# Altium schematic sheet EFR32.SchDoc: EFR32BG13
size Letter; DrawnBy: Vishnu Kumar; DocumentNumber: 1; Revision: 1; SheetNumber: 2; SheetTotal: 3
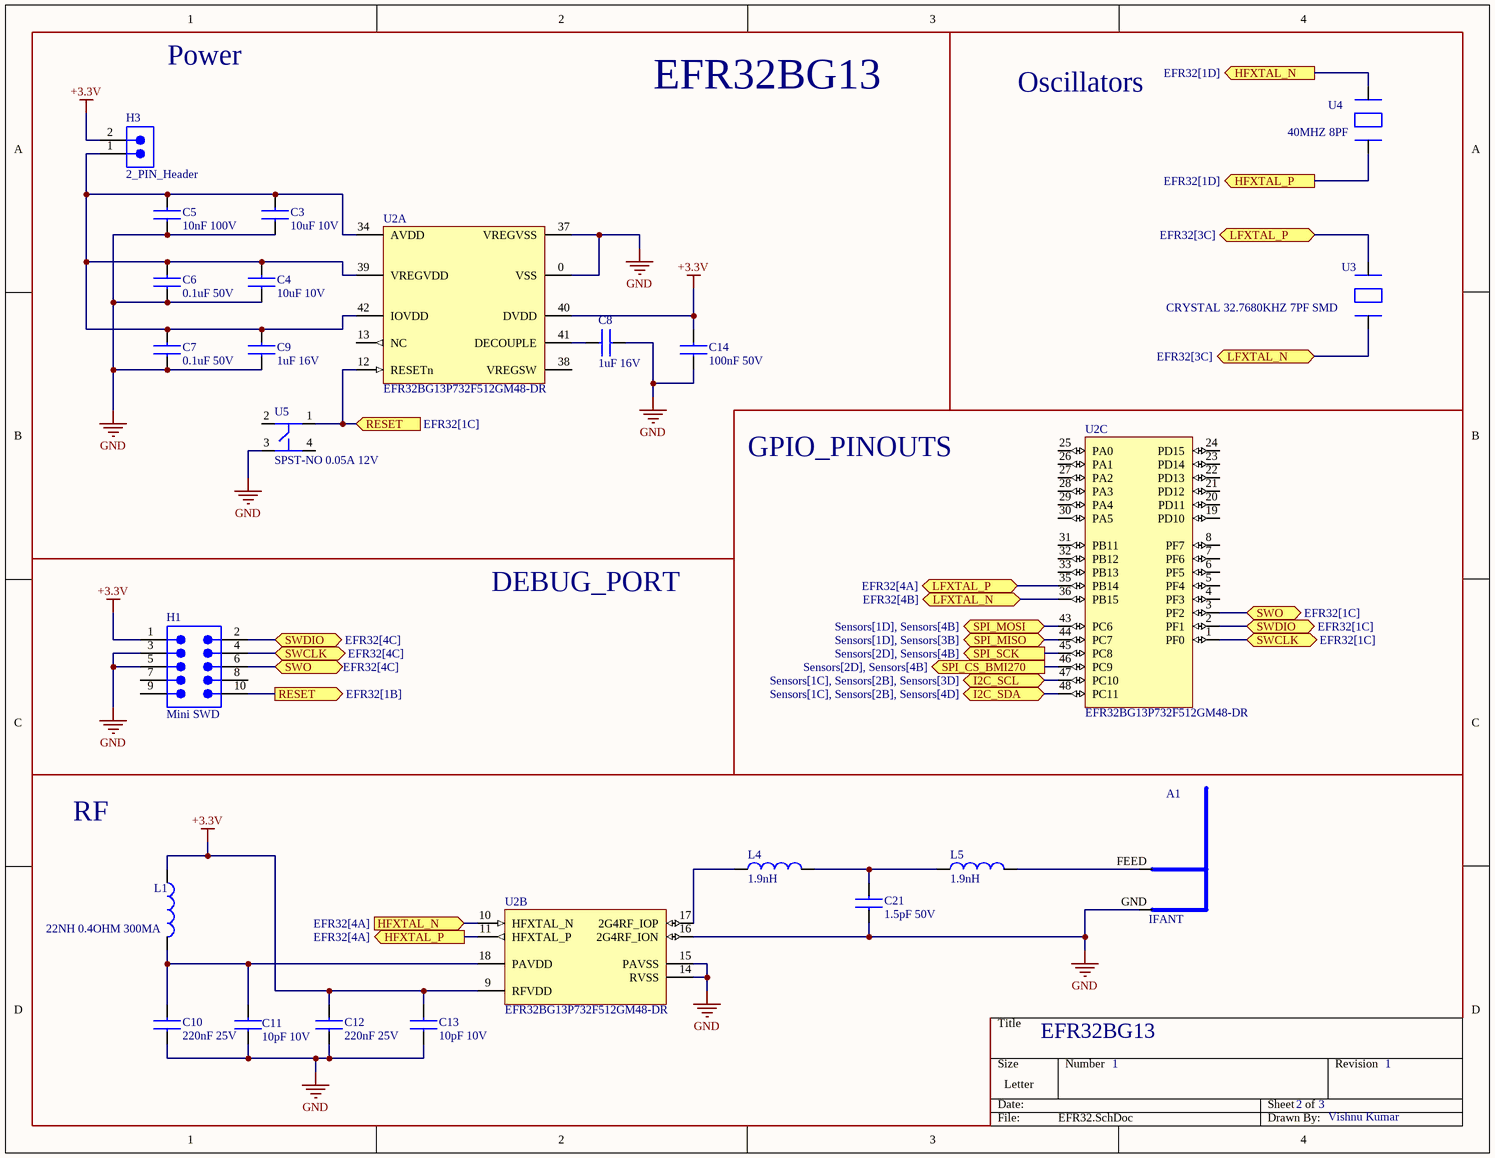
[diagram p0: EFR32.SchDoc]

## Parts
A1  IFANT  [IFANT_2P4]
C3  10uF 10V  [CAP_0603_1MM]
C4  10uF 10V  [CAP_0603_1MM]
C5  10nF 100V  [CAP_0603_1MM]
C6  0.1uF 50V  [CAP_0603_1MM]
C7  0.1uF 50V  [CAP_0603_1MM]
C8  1uF 16V  [CAP_0603_1MM]
C9  1uF 16V  [CAP_0603_1MM]
C10  220nF 25V  [CAP_0603_1MM]
C11  10pF 10V  [CAP_0603_1MM]
C12  220nF 25V  [CAP_0603_1MM]
C13  10pF 10V  [CAP_0603_1MM]
C14  100nF 50V  [CAP_0603_1MM]
C21  1.5pF 50V  [CAPC1005X55N]
H1  Mini SWD  [FTSH-105-01-XXX-DV-K]
H3  2_PIN_Header  [2-PIN_MALE_HEADER_01-IN]
L1  22NH 0.4OHM 300MA  [IND_0603_1MM]
L4  1.9nH  [CAPC1005X55N]
L5  1.9nH  [CAPC1005X55N]
U2  EFR32BG13P732F512GM48-DR  [QFN48P700X700X90_HS-49N]  (parts A,B,C of 3)
U3  CRYSTAL 32.7680KHZ 7PF SMD  [Oscillator_32.768kHz_SC32S-7PF20PPM]
U4  40MHZ 8PF  [OSCILLATOR_40MHz_LNCD1-40M]
U5  SPST-NO 0.05A 12V  [SPDT Switch]

## Ports
HFXTAL_N (in, see EFR32[4A]), HFXTAL_N (out, see EFR32[1D]), HFXTAL_P (out, see EFR32[1D]), HFXTAL_P (out, see EFR32[4A]), I2C_SCL (bidir, see Sensors[1C], Sensors[2B], Sensors[3D]), I2C_SDA (bidir, see Sensors[1C], Sensors[2B], Sensors[4D]), LFXTAL_N (bidir, see EFR32[3C]), LFXTAL_N (bidir, see EFR32[4B]), LFXTAL_P (bidir, see EFR32[3C]), LFXTAL_P (bidir, see EFR32[4A]), RESET (in, see EFR32[1C]), RESET (out, see EFR32[1B]), SPI_CS_BMI270 (out, see Sensors[2D], Sensors[4B]), SPI_MISO (bidir, see Sensors[1D], Sensors[3B]), SPI_MOSI (bidir, see Sensors[1D], Sensors[4B]), SPI_SCK (out, see Sensors[2D], Sensors[4B]), SWCLK (bidir, see EFR32[1C]), SWCLK (bidir, see EFR32[4C]), SWDIO (bidir, see EFR32[1C]), SWDIO (bidir, see EFR32[4C]), SWO (bidir, see EFR32[1C]), SWO (bidir, see EFR32[4C])

## Nets
+3.3V: C12.1 C13.2 C14.1 H1.1 H3.2 L1.1 U2.9(RFVDD) U2.40(DVDD)
GND: A1.GND C3.2 C4.2 C5.1 C6.1 C7.2 C8.2 C9.2 C10.2 C11.2 C12.2 C13.1 C14.2 C21.2 H1.3 H1.5 U2.0(VSS) U2.14(RVSS) U2.15(PAVSS) U2.16(2G4RF_ION) U2.37(VREGVSS) U5.3
HFXTAL_N: U2.10(HFXTAL_N) U4.1 ; port HFXTAL_N
HFXTAL_P: U2.11(HFXTAL_P) U4.2 ; port HFXTAL_P
I2C_SCL: U2.47(PC10) ; port I2C_SCL
I2C_SDA: U2.48(PC11) ; port I2C_SDA
LFXTAL_N: U2.36(PB15) U3.1 ; port LFXTAL_N
LFXTAL_P: U2.35(PB14) U3.2 ; port LFXTAL_P
RESET: H1.10 U2.12(RESETn) U5.1 ; port RESET
SPI_CS_BMI270: U2.46(PC9) ; port SPI_CS_BMI270
SPI_MISO: U2.44(PC7) ; port SPI_MISO
SPI_MOSI: U2.43(PC6) ; port SPI_MOSI
SPI_SCK: U2.45(PC8) ; port SPI_SCK
SWCLK: H1.4 U2.1(PF0) ; port SWCLK
SWDIO: H1.2 U2.2(PF1) ; port SWDIO
SWO: H1.6 U2.3(PF2) ; port SWO
NetA1_FEED: A1.FEED L5.2
NetC3_1: C3.1 C4.1 C5.2 C6.2 C7.1 C9.1 H3.1 U2.34(AVDD) U2.39(VREGVDD) U2.42(IOVDD)
NetC8_1: C8.1 U2.41(DECOUPLE)
NetC10_1: C10.1 C11.1 L1.2 U2.18(PAVDD)
NetC21_1: C21.1 L4.2 L5.1
NetL4_1: L4.1 U2.17(2G4RF_IOP)

Not connected (* = marked no-connect by the designer): H1 7 8 9; U2 4(PF3) 5(PF4) 6(PF5) 7(PF6) 8(PF7) 13(NC) 19(PD10) 20(PD11) 21(PD12) 22(PD13) 23(PD14) 24(PD15) 25(PA0) 26(PA1) 27(PA2) 28(PA3) 29(PA4) 30(PA5) 31(PB11) 32(PB12) 33(PB13) 38(VREGSW); U5 2 4

## Notes on the sheet
- Power
- EFR32BG13
- Oscillators
- GPIO_PINOUTS
- DEBUG_PORT
- RF

## Library data of the parts
A1 = IFANT_2P4
C3 C4 = CC_10uF_10v_0603: Ceramic Capacitor, Multilayer, Ceramic, 10V, 20% +Tol, 20% -Tol, X5R, 15% TC, 10uF, Surface Mount, 0603; Manufacturer: Cal-Chip Electronics; Manufacturer Part Number: GMC10X5R106M10NT; Multilayer: Yes; Supplier: Digikey; Supplier Part Number: 4713-GMC10X5R106M10NTCT-ND; RoHS: Yes; Stock: 109451; Pricing: 1=0.1, 10=0.053, 50=0.0362, 100=0.0312, 500=0.02258, 1000=0.01991 (USD); Mounting Technology: Surface Mount; Pins: 2; Dielectric Material: Ceramic; Package Shape: Rectangular; Case/Package: 0603; Terminal Finish: Nickel; Min Operating Temperature: -55°C; Max Operating Temperature: 85°C; JESD-609 Code: e3; Value: 10uF; Capacitor Type: Ceramic; Tolerance  (fill in as +-): 20%; Package Style: SMTMeter; Packaging: Tape and Reel; Tolerance (fill in as +-): 20%; Rated DC Voltage (URdc): 10V; Temperature Characteristics Code: X5R; Termination: Wraparound; Length: 1.6mm; Width: 0.8mm; Height: 0.8mm; Reach SVHC Compliant: Yes; RoHS Compliant: Yes; ComponentLink1URL: https://datasheet.ciiva.com:443/pdfs/VipMasterIC/IC/CALC/CALC-S-A0005264378/CALC-S-A0005264378-1.pdf?src-supplier=IHS+Markit; ComponentLink1Description: https://datasheet.ciiva.com:443/pdfs/VipMasterIC/IC/CALC/CALC-S-A0005264378/CALC-S-A0005264378-1.pdf?src-supplier=IHS+Markit
C5 = GCM188R72A103KA37D: Ceramic Capacitor, Multilayer, Ceramic, 100V, 10% +Tol, 10% -Tol, X7R, 15% TC, 0.01uF, Surface Mount, 0603; Manufacturer: Murata; Multilayer: Yes; Reference Standard: AEC-Q200; Supplier: Digikey; Supplier Part Number: 490-4781-1-ND; Manufacturer Part Number: GCM188R72A103KA37D; RoHS: Yes; Category: Ceramic Capacitors; Stock: 6381052; Pricing: 1=0.1, 10=0.03, 50=0.0204, 100=0.0174, 500=0.0125, 1000=0.01097 (USD); Mounting Technology: Surface Mount; Pins: 2; Dielectric Material: Ceramic; Package Shape: Rectangular; Case/Package: 0603; Terminal Finish: Nickel; Min Operating Temperature: -55°C; Max Operating Temperature: 125°C; JESD-609 Code: e3; Value: 10nF; Capacitor Type: Ceramic; Tolerance  (fill in as +-): 10%; Package Style: SMTMeter; Packaging: Tape and Reel; Tolerance (fill in as +-): 10%; Rated DC Voltage (URdc): 100V; Temperature Characteristics Code: X7R; Termination: Wraparound; Length: 1.6mm; Width: 0.8mm; Height: 0.9mm; Reach SVHC Compliant: Yes; RoHS Compliant: Yes; ComponentLink1URL: https://psearch.en.murata.com:443/capacitor/product/GCM188R72A103KA37%23.pdf?src-supplier=IHS+Markit; ComponentLink1Description: https://psearch.en.murata.com:443/capacitor/product/GCM188R72A103KA37%23.pdf?src-supplier=IHS+Markit; ComponentLink2URL: https://datasheet.ciiva.com/132/product-132907.pdf?src-supplier=Digikey; ComponentLink2Description: https://datasheet.ciiva.com/132/product-132907.pdf?src-supplier=Digikey; ComponentLink3URL: https://datasheet.ciiva.com/132/product-132908.pdf?src-supplier=Digikey; ComponentLink3Description: https://datasheet.ciiva.com/132/product-132908.pdf?src-supplier=Digikey; ComponentLink4URL: https://datasheet.ciiva.com/132/product-132909.pdf?src-supplier=Digikey; ComponentLink4Description: https://datasheet.ciiva.com/132/product-132909.pdf?src-supplier=Digikey; ComponentLink5URL: https://datasheet.ciiva.com/11786/0900766b80ef92d0-11786108.pdf?src-supplier=Rs; ComponentLink5Description: https://datasheet.ciiva.com/11786/0900766b80ef92d0-11786108.pdf?src-supplier=Rs; ComponentLink6URL: https://datasheet.ciiva.com/16497/product-16497251.pdf?src-supplier=Future+Electronics; ComponentLink6Description: https://datasheet.ciiva.com/16497/product-16497251.pdf?src-supplier=Future+Electronics; ComponentLink7URL: https://datasheet.ciiva.com/18183/getdatasheetpartid-178890-18183651.pdf?src-supplier=Verical; ComponentLink7Description: https://datasheet.ciiva.com/18183/getdatasheetpartid-178890-18183651.pdf?src-supplier=Verical; ComponentLink8URL: https://datasheet.ciiva.com/11619/product-11619719.pdf?src-supplier=Avnet; ComponentLink8Description: https://datasheet.ciiva.com/11619/product-11619719.pdf?src-supplier=Avnet
C6 C7 = CC_0.1uF_0603_ZRY5V9BB104: Ceramic Capacitor, Multilayer, Ceramic, 50V, 80% +Tol, 20% -Tol, Y5V, -82/+22% TC, 0.1uF, Surface Mount, 0603; Manufacturer: Yageo; Manufacturer Part Number: CC0603ZRY5V9BB104; Value: 100nF; Multilayer: Yes; Supplier: Digikey; Supplier Part Number: 311-1343-1-ND; RoHS: Yes; Category: Ceramic Capacitors; Stock: 7870307; Pricing: 1=0.1, 10=0.028, 50=0.0162, 100=0.0125, 500=0.00944, 1000=0.00742 (USD); Mounting Technology: Surface Mount; Pins: 2; Dielectric Material: Ceramic; Package Shape: Rectangular; Case/Package: 0603; Terminal Finish: Nickel; Min Operating Temperature: -30°C; Max Operating Temperature: 85°C; JESD-609 Code: e3; Capacitor Type: Ceramic; Tolerance  (fill in as +-): 20%; Package Style: SMTMeter; Packaging: Tape and Reel; Tolerance (fill in as +-): 80%; Rated DC Voltage (URdc): 50V; Temperature Characteristics Code: Y5V; Termination: Wraparound; Length: 1.6mm; Width: 0.8mm; Height: 0.8mm; Reach SVHC Compliant: Yes; RoHS Compliant: Yes; ComponentLink1URL: https://datasheet.ciiva.com:443/pdfs/VipMasterIC/IC/YAGO/YAGO-S-A0004841839/YAGO-S-A0004841839-1.pdf?src-supplier=IHS+Markit; ComponentLink1Description: https://datasheet.ciiva.com:443/pdfs/VipMasterIC/IC/YAGO/YAGO-S-A0004841839/YAGO-S-A0004841839-1.pdf?src-supplier=IHS+Markit; ComponentLink2URL: https://datasheet.ciiva.com/144/mlccorderingcode-144027.pdf?src-supplier=Digikey; ComponentLink2Description: https://datasheet.ciiva.com/144/mlccorderingcode-144027.pdf?src-supplier=Digikey; ComponentLink3URL: https://datasheet.ciiva.com/11786/0900766b8079c870-11786029.pdf?src-supplier=Rs; ComponentLink3Description: https://datasheet.ciiva.com/11786/0900766b8079c870-11786029.pdf?src-supplier=Rs; ComponentLink4URL: https://datasheet.ciiva.com/144/mlccorderingcode-144025.pdf?src-supplier=Digikey; ComponentLink4Description: https://datasheet.ciiva.com/144/mlccorderingcode-144025.pdf?src-supplier=Digikey; ComponentLink5URL: https://datasheet.ciiva.com/144/mlccorderingcode-144026.pdf?src-supplier=Digikey; ComponentLink5Description: https://datasheet.ciiva.com/144/mlccorderingcode-144026.pdf?src-supplier=Digikey; ComponentLink6URL: https://datasheet.ciiva.com/5427/upy-gphc-y5v-6-3v-to-50v-5-5427420.pdf?src-supplier=Mouser; ComponentLink6Description: https://datasheet.ciiva.com/5427/upy-gphc-y5v-6-3v-to-50v-5-5427420.pdf?src-supplier=Mouser; ComponentLink7URL: https://datasheet.ciiva.com/28450/1132289-28450702.pdf?src-supplier=Element14; ComponentLink7Description: https://datasheet.ciiva.com/28450/1132289-28450702.pdf?src-supplier=Element14; ComponentLink8URL: https://datasheet.ciiva.com/26829/getdatasheetpartid-403611-26829467.pdf?src-supplier=Verical; ComponentLink8Description: https://datasheet.ciiva.com/26829/getdatasheetpartid-403611-26829467.pdf?src-supplier=Verical
C8 C9 = CC_1uF_16v_0603: Ceramic Capacitor, Multilayer, Ceramic, 16V, 10% +Tol, 10% -Tol, X5R, 15% TC, 1uF, Surface Mount, 0603; Manufacturer: Samsung; Manufacturer Part Number: CL10A105KO8NNND; Multilayer: Yes; Supplier: Digikey; Supplier Part Number: 1276-CL10A105KO8NNNDCT-ND; RoHS: Yes; Category: Ceramic Capacitors; Stock: 29219; Pricing: 1=0.1, 10=0.029, 50=0.0194, 100=0.0165, 500=0.01166, 1000=0.01017, 2500=0.0086, 5000=0.00764 (USD); Mounting Technology: Surface Mount; Pins: 2; Dielectric Material: Ceramic; Package Shape: Rectangular; Case/Package: 0603; Terminal Finish: Nickel; Min Operating Temperature: -55°C; Max Operating Temperature: 85°C; JESD-609 Code: e3; Value: 1uF; Capacitor Type: Ceramic; Tolerance  (fill in as +-): 10%; Package Style: SMTMeter; Packaging: Tape and Reel; Tolerance (fill in as +-): 10%; Rated DC Voltage (URdc): 16V; Temperature Characteristics Code: X5R; Termination: Wraparound; Length: 1.6mm; Width: 0.8mm; Height: 0.9mm; Reach SVHC Compliant: Yes; RoHS Compliant: Yes; ComponentLink1URL: https://datasheet.ciiva.com:443/pdfs/VipMasterIC/IC/SEMS/SEMS-S-A0008520814/SEMS-S-A0008520822-1.pdf?src-supplier=IHS+Markit; ComponentLink1Description: https://datasheet.ciiva.com:443/pdfs/VipMasterIC/IC/SEMS/SEMS-S-A0008520814/SEMS-S-A0008520822-1.pdf?src-supplier=IHS+Markit; ComponentLink2URL: https://datasheet.ciiva.com/15195/getdatasheetpartid-353183-15195707.pdf?src-supplier=Verical; ComponentLink2Description: https://datasheet.ciiva.com/15195/getdatasheetpartid-353183-15195707.pdf?src-supplier=Verical
C10 C12 = CC_220nF_25V_0603: Ceramic Capacitor, Multilayer, Ceramic, 25V, 10% +Tol, 10% -Tol, X5R, 15% TC, 0.22uF, Surface Mount, 0603; Manufacturer: Walsin Technologies; Manufacturer Part Number: 0603X224K250CT; Multilayer: Yes; Supplier: Digikey; Supplier Part Number: 1292-1552-1-ND; RoHS: Yes; Category: Ceramic Capacitors; Stock: 22060; Pricing: 1=0.1, 10=0.037, 50=0.0212, 100=0.0164, 500=0.01234, 1000=0.00969 (USD); Mounting Technology: Surface Mount; Pins: 2; Dielectric Material: Ceramic; Package Shape: Rectangular; Case/Package: 0603; Terminal Finish: Nickel; Min Operating Temperature: -55°C; Max Operating Temperature: 85°C; JESD-609 Code: e3; Value: 220nF; Capacitor Type: Ceramic; Tolerance  (fill in as +-): 10%; Package Style: SMTMeter; Packaging: Tape and Reel; Tolerance (fill in as +-): 10%; Rated DC Voltage (URdc): 25V; Temperature Characteristics Code: X5R; Termination: Wraparound; Length: 1.6mm; Width: 0.8mm; Height: 0.8mm; Reach SVHC Compliant: Yes; RoHS Compliant: Yes; ComponentLink1URL: https://datasheet.ciiva.com:443/pdfs/VipMasterIC/IC/WATC/WATC-S-A0009550342/WATC-S-A0009550342-1.pdf?src-supplier=IHS+Markit; ComponentLink1Description: https://datasheet.ciiva.com:443/pdfs/VipMasterIC/IC/WATC/WATC-S-A0009550342/WATC-S-A0009550342-1.pdf?src-supplier=IHS+Markit; ComponentLink2URL: http://www.farnell.com/datasheets/1958513.pdf?src-supplier=Farnell; ComponentLink2Description: http://www.farnell.com/datasheets/1958513.pdf?src-supplier=Farnell; ComponentLink3URL: https://datasheet.octopart.com/0603X224K250CT-Walsin-Technologies-datasheet-85392065.pdf?src-supplier=Element14; ComponentLink3Description: https://datasheet.octopart.com/0603X224K250CT-Walsin-Technologies-datasheet-85392065.pdf?src-supplier=Element14; ComponentLink4URL: http://www.passivecomponent.com/wp-content/uploads/2018/10/MLCC.pdf?src-supplier=Digikey; ComponentLink4Description: http://www.passivecomponent.com/wp-content/uploads/2018/10/MLCC.pdf?src-supplier=Digikey; ComponentLink5URL: https://datasheet.octopart.com/0603X224K250CT-Walsin-Technologies-datasheet-157857041.pdf?src-supplier=Future+Electronics; ComponentLink5Description: https://datasheet.octopart.com/0603X224K250CT-Walsin-Technologies-datasheet-157857041.pdf?src-supplier=Future+Electronics; ComponentLink6URL: https://datasheet.octopart.com/0603X224K250CT-Walsin-Technologies-datasheet-136037192.pdf?src-supplier=TECHDesign; ComponentLink6Description: https://datasheet.octopart.com/0603X224K250CT-Walsin-Technologies-datasheet-136037192.pdf?src-supplier=TECHDesign
C11 C13 = CC_10pF_10V_0603: 10 pF ±5% 10V Ceramic Capacitor C0G, NP0 0603 (1608 Metric); Supplier: Digikey; Supplier Part Number: 732-7746-1-ND
C14 = CC_0.1uF_0603_ZRY5V9BB104: Ceramic Capacitor, Multilayer, Ceramic, 50V, 80% +Tol, 20% -Tol, Y5V, -82/+22% TC, 0.1uF, Surface Mount, 0603; Manufacturer: Yageo; Manufacturer Part Number: CC0603ZRY5V9BB104; Multilayer: Yes; Supplier: Digikey; Supplier Part Number: 311-1343-1-ND; RoHS: Yes; Category: Ceramic Capacitors; Stock: 7870307; Pricing: 1=0.1, 10=0.028, 50=0.0162, 100=0.0125, 500=0.00944, 1000=0.00742 (USD); Mounting Technology: Surface Mount; Pins: 2; Dielectric Material: Ceramic; Package Shape: Rectangular; Case/Package: 0603; Terminal Finish: Nickel; Min Operating Temperature: -30°C; Max Operating Temperature: 85°C; JESD-609 Code: e3; Value: 100nF; Capacitor Type: Ceramic; Tolerance  (fill in as +-): 20%; Package Style: SMTMeter; Packaging: Tape and Reel; Tolerance (fill in as +-): 80%; Rated DC Voltage (URdc): 50V; Temperature Characteristics Code: Y5V; Termination: Wraparound; Length: 1.6mm; Width: 0.8mm; Height: 0.8mm; Reach SVHC Compliant: Yes; RoHS Compliant: Yes; ComponentLink1URL: https://datasheet.ciiva.com:443/pdfs/VipMasterIC/IC/YAGO/YAGO-S-A0004841839/YAGO-S-A0004841839-1.pdf?src-supplier=IHS+Markit; ComponentLink1Description: https://datasheet.ciiva.com:443/pdfs/VipMasterIC/IC/YAGO/YAGO-S-A0004841839/YAGO-S-A0004841839-1.pdf?src-supplier=IHS+Markit; ComponentLink2URL: https://datasheet.ciiva.com/144/mlccorderingcode-144027.pdf?src-supplier=Digikey; ComponentLink2Description: https://datasheet.ciiva.com/144/mlccorderingcode-144027.pdf?src-supplier=Digikey; ComponentLink3URL: https://datasheet.ciiva.com/11786/0900766b8079c870-11786029.pdf?src-supplier=Rs; ComponentLink3Description: https://datasheet.ciiva.com/11786/0900766b8079c870-11786029.pdf?src-supplier=Rs; ComponentLink4URL: https://datasheet.ciiva.com/144/mlccorderingcode-144025.pdf?src-supplier=Digikey; ComponentLink4Description: https://datasheet.ciiva.com/144/mlccorderingcode-144025.pdf?src-supplier=Digikey; ComponentLink5URL: https://datasheet.ciiva.com/144/mlccorderingcode-144026.pdf?src-supplier=Digikey; ComponentLink5Description: https://datasheet.ciiva.com/144/mlccorderingcode-144026.pdf?src-supplier=Digikey; ComponentLink6URL: https://datasheet.ciiva.com/5427/upy-gphc-y5v-6-3v-to-50v-5-5427420.pdf?src-supplier=Mouser; ComponentLink6Description: https://datasheet.ciiva.com/5427/upy-gphc-y5v-6-3v-to-50v-5-5427420.pdf?src-supplier=Mouser; ComponentLink7URL: https://datasheet.ciiva.com/28450/1132289-28450702.pdf?src-supplier=Element14; ComponentLink7Description: https://datasheet.ciiva.com/28450/1132289-28450702.pdf?src-supplier=Element14; ComponentLink8URL: https://datasheet.ciiva.com/26829/getdatasheetpartid-403611-26829467.pdf?src-supplier=Verical; ComponentLink8Description: https://datasheet.ciiva.com/26829/getdatasheetpartid-403611-26829467.pdf?src-supplier=Verical
C21 = CC_1.5pF_885012005050: 1.5 pF ±0.5pF 50V Ceramic Capacitor C0G, NP0 0402 (1005 Metric); Manufacturer: Wurth Electronics; Supplier: Digikey; Supplier Part Number: 732-12249-1-ND; Manufacturer Part Number: 885012005050; RoHS: Yes; Category: Ceramic Capacitors; Stock: 24790; Pricing: 1=0.1, 10=0.015, 100=0.014, 500=0.012 (USD); Pins: 2; Dielectric Material: Ceramic; Capacitor Type: Ceramic; Reach SVHC Compliant: Yes; RoHS Compliant: Yes; ComponentLink1URL: https://datasheet.ciiva.com:443/pdfs/VipMasterIC/IC/MIDC/MIDC-S-A0001525369/MIDC-S-A0001525129-1.pdf?src-supplier=IHS+Markit; ComponentLink1Description: https://datasheet.ciiva.com:443/pdfs/VipMasterIC/IC/MIDC/MIDC-S-A0001525369/MIDC-S-A0001525129-1.pdf?src-supplier=IHS+Markit; ComponentLink2URL: https://katalog.we-online.de/pbs/datasheet/885012005050.pdf?src-supplier=Digikey; ComponentLink2Description: https://katalog.we-online.de/pbs/datasheet/885012005050.pdf?src-supplier=Digikey
H1 = Debug Connector Mini SWD - 0.05": Mini SWD 0.05" Pitch Connector - 10 Pin SMT Box Header; Manufacturer: Adafruit Industries; Manufacturer Part Number: 4048; Supplier 1: Digi-Key; RoHS: No; Category: Connectors; Stock 1: 201; Pricing 1: 1=1.95000 (USD); ComponentLink1URL: https://media.digikey.com/pdf/Data%20Sheets/Adafruit%20PDFs/4048_Web.pdf?src-supplier=Digi-Key; ComponentLink1Description: https://media.digikey.com/pdf/Data%20Sheets/Adafruit%20PDFs/4048_Web.pdf?src-supplier=Digi-Key
H3 = PRPC002SAAN-RC: CONN HEADER VERT 2POS 2.54MM; Manufacturer: Sullins; Connector Type: Header, Unshrouded, Breakaway; Number of Positions: 2; Number of Positions Loaded: All; Pitch: 0.100" (2.54mm); Online Catalog: 0.100" (2.54mm) Pitch Connector Headers; Other Names: S9510E-02  S9510E-02-ND; Supplier 1: Digi-Key; Manufacturer Part Number: PRPC002SAAN-RC; Stock 1: 42739; Pricing 1: 1=0.08, 10=0.073, 25=0.054, 50=0.0464, 100=0.0449, 250=0.0387, 500=0.0372 (USD); Standard Package: 1; Category: Connectors, Interconnects; Family: Rectangular Connectors - Headers, Male Pins; Series: -; Packaging: Bulk; Contact Type: Male Pin; Number of Rows: 1; Row Spacing: -; Contact Mating Length: 0.230" (5.84mm); Mounting Type: Through Hole; Termination: Solder; Fastening Type: -; Features: -; Contact Finish: Gold; Contact Finish Thickness: Flash; Color: Black; ComponentLink1URL: https://media.digikey.com/PDF/Data%20Sheets/Sullins%20PDFs/xRxCzzzSxxN-RC_ST_11635-B.pdf?src-supplier=Digi-Key; ComponentLink1Description: https://media.digikey.com/PDF/Data%20Sheets/Sullins%20PDFs/xRxCzzzSxxN-RC_ST_11635-B.pdf?src-supplier=Digi-Key; Supplier Part Number 1: S1011EC-02-ND
L1 = IND_22nH_0.4OHM_300MA: 22 nH Unshielded Multilayer Inductor 300 mA 400mOhm Max 0603 (1608 Metric); Manufacturer: Tai Tech; Manufacturer Part Number: HCI1608F-22NJ-M; Supplier: DigiKey; Supplier Part Number: 4816-HCI1608F-22NJ-MCT-ND; Stock: 3940; Pricing: 1=0.1, 10=0.036, 25=0.0324, 50=0.03, 100=0.0278, 250=0.02512, 500=0.0233, 1000=0.02159 (USD)
L4 L5 = IND_1.9nH: General Purpose Inductor, 0.0019uH, 10.527%, 1 Element, Ceramic-Core, SMD, 0402; Manufacturer: Wurth Electronics; Manufacturer Part Number: 744765019A; DC Resistance (DCR): 70mR; Inductor Application: RF INDUCTOR; Channels: 1; Quality Factor-Min (at L-nom): 16; Max Current Rating: 1.04A; Self Resonant Frequency: 6GHz; Shape/Size Description: RECTANGULAR PACKAGE; Shielding: Unshielded; Test Frequency: 250MHz; Case/Size Code: 0402; Package Height: 0.5mm; Package Length: 1mm; Package Width: 0.55mm; Supplier: Digikey; Supplier Part Number: 732-1704-1-ND; RoHS: Yes; Category: Fixed Inductors; Stock: 10348; Pricing: 1=0.43, 10=0.416, 50=0.387, 100=0.358, 500=0.33, 1000=0.301 (USD); Pins: 2; Terminal Finish: Nickel; Core Material: Ceramic; Min Operating Temperature: -40°C; Max Operating Temperature: 125°C; Tolerance: 10.527%; Inductor Type: GENERAL PURPOSE INDUCTOR; Inductance-Nom (L): 0.0019uH; Surface Mount: Yes; Terminal Placement: Dual Ended; Termination: Wraparound; Construction: Unshielded; Package Style: SMTMeter; JESD-609 Code: e4; Series: 744765019A; Reach SVHC Compliant: Yes; RoHS Compliant: Yes; ComponentLink1URL: https://datasheet.ciiva.com:443/pdfs/VipMasterIC/IC/MIDC/MIDC-S-A0007763706/MIDC-S-A0007768436-1.pdf?src-supplier=IHS+Markit; ComponentLink1Description: https://datasheet.ciiva.com:443/pdfs/VipMasterIC/IC/MIDC/MIDC-S-A0007763706/MIDC-S-A0007768436-1.pdf?src-supplier=IHS+Markit; ComponentLink2URL: https://datasheet.ciiva.com/11803/0900766b80f88b3a-11803480.pdf?src-supplier=Rs; ComponentLink2Description: https://datasheet.ciiva.com/11803/0900766b80f88b3a-11803480.pdf?src-supplier=Rs; ComponentLink3URL: https://datasheet.ciiva.com/4978/744765019a-69516-4978713.pdf?src-supplier=Mouser; ComponentLink3Description: https://datasheet.ciiva.com/4978/744765019a-69516-4978713.pdf?src-supplier=Mouser; ComponentLink4URL: https://datasheet.ciiva.com/1048/744765019a-1048956.pdf?src-supplier=Digikey; ComponentLink4Description: https://datasheet.ciiva.com/1048/744765019a-1048956.pdf?src-supplier=Digikey; ComponentLink5URL: https://datasheet.ciiva.com/1048/744765019a-1048957.pdf?src-supplier=Digikey; ComponentLink5Description: https://datasheet.ciiva.com/1048/744765019a-1048957.pdf?src-supplier=Digikey; ComponentLink6URL: https://datasheet.ciiva.com/1048/744765019a-1048958.pdf?src-supplier=Digikey; ComponentLink6Description: https://datasheet.ciiva.com/1048/744765019a-1048958.pdf?src-supplier=Digikey
U2 = EFR32BG13P732F512GM48-DR: IC RF TXRX+MCU BLE 48QFN; Manufacturer: Silicon Labs; Supplier: Digikey; Supplier Part Number: 336-EFR32BG13P732F512GM48-DRCT-ND; Manufacturer Part Number: EFR32BG13P732F512GM48-DR; RoHS: No; Category: RF Receivers, Transceivers; Stock: 8814; Pricing: 1=7.73, 10=7.088, 25=6.444, 100=5.7994, 250=5.31612, 500=4.83284, 1000=4.34956 (USD); RoHS Compliant: Yes; ComponentLink1URL: https://www.silabs.com/documents/login/data-sheets/efr32bg13-datasheet.pdf?src-supplier=Digikey; ComponentLink1Description: https://www.silabs.com/documents/login/data-sheets/efr32bg13-datasheet.pdf?src-supplier=Digikey
U3 = Oscillator_32.768kHz: 32.768 kHz ±20ppm Crystal 7pF 70 kOhms 2-SMD, No Lead; Manufacturer: Seiko; Manufacturer Part Number: SC32S-7PF20PPM; Aging: 3 PPM/FIRST YEAR; Crystal/Resonator Type: PARALLEL - FUNDAMENTAL; Drive Level: 0.1uW; Operating Frequency-Nom: 0.032768; ESR: 70kR; Supplier: Digikey; Supplier Part Number: 728-1074-1-ND; RoHS: Yes; Category: Crystals; Stock: 140980; Pricing: 1=0.38, 10=0.316, 50=0.284, 100=0.2525, 500=0.23988, 1000=0.202, 3000=0.18937, 6000=0.18306, 15000=0.17675 (USD); Mounting Technology: Surface Mount; Min Operating Temperature: -40°C; Max Operating Temperature: 85°C; Frequency Tolerance: 20ppm; Load Capacitance: 7pF; Reach SVHC Compliant: Yes; RoHS Compliant: Yes; ComponentLink1URL: https://datasheet.ciiva.com:443/pdfs/VipMasterIC/IC/SIIS/SIISS03527/SIISS03527-1.pdf?src-supplier=IHS+Markit; ComponentLink1Description: https://datasheet.ciiva.com:443/pdfs/VipMasterIC/IC/SIIS/SIISS03527/SIISS03527-1.pdf?src-supplier=IHS+Markit; ComponentLink2URL: http://www.mouser.com/ds/2/360/file_PRODUCT_MASTER_50812_GRAPHIC03-542305.pdf?src-supplier=Mouser; ComponentLink2Description: http://www.mouser.com/ds/2/360/file_PRODUCT_MASTER_50812_GRAPHIC03-542305.pdf?src-supplier=Mouser; ComponentLink3URL: http://www.sii.co.jp/en/quartz/files/2013/03/file_PRODUCT_MASTER_50812_GRAPHIC03.pdf?src-supplier=Digikey; ComponentLink3Description: http://www.sii.co.jp/en/quartz/files/2013/03/file_PRODUCT_MASTER_50812_GRAPHIC03.pdf?src-supplier=Digikey; ComponentLink4URL: https://www.sii.co.jp/en/quartz/files/2013/03/SC-32S_Leaflet_e20151217.pdf?src-supplier=Digikey; ComponentLink4Description: https://www.sii.co.jp/en/quartz/files/2013/03/SC-32S_Leaflet_e20151217.pdf?src-supplier=Digikey
U4 = Oscillator_40MHz: 40 MHz ±50ppm Crystal 8pF 50 Ohms 2-SMD, No Lead; Manufacturer: NDK; Manufacturer Part Number: LNCD1-40M; Supplier: Digikey; Supplier Part Number: 644-LNCD1-40MCT-ND; RoHS: No; Category: LDO; Stock: 3869; Pricing: 1=0.58, 10=0.501, 50=0.4516, 100=0.4319, 500=0.38952 (USD)
U5 = Push_Button: Keypad Switch, 1 Switches, SPST, Momentary-tactile, 0.05A, 12VDC, 1.47N, Solder Terminal, Surface Mount-straight; Manufacturer: ITT C&K; Manufacturer Part Number: PTS647SN50SMTR2LFS; Supplier: Digikey; Supplier Part Number: PTS647SN50SMTR2LFSCT-ND; RoHS: No; Stock: 525945; Pricing: 1=0.18, 10=0.175, 25=0.166, 100=0.1503, 250=0.137, 500=0.12734 (USD); RoHS Compliant: Yes; ComponentLink1URL: https://www.ckswitches.com/media/2567/pts647.pdf?src-supplier=Digikey; ComponentLink1Description: https://www.ckswitches.com/media/2567/pts647.pdf?src-supplier=Digikey; ComponentLink2URL: https://datasheet.octopart.com/PTS647SN50SMTR2LFS-C%26K-Components-datasheet-117317067.pdf?src-supplier=Future+Electronics; ComponentLink2Description: https://datasheet.octopart.com/PTS647SN50SMTR2LFS-C%26K-Components-datasheet-117317067.pdf?src-supplier=Future+Electronics; ComponentLink3URL: https://datasheet.octopart.com/PTS647SN50SMTR2LFS-C%26K-Components-datasheet-156105943.pdf?src-supplier=TME; ComponentLink3Description: https://datasheet.octopart.com/PTS647SN50SMTR2LFS-C%26K-Components-datasheet-156105943.pdf?src-supplier=TME